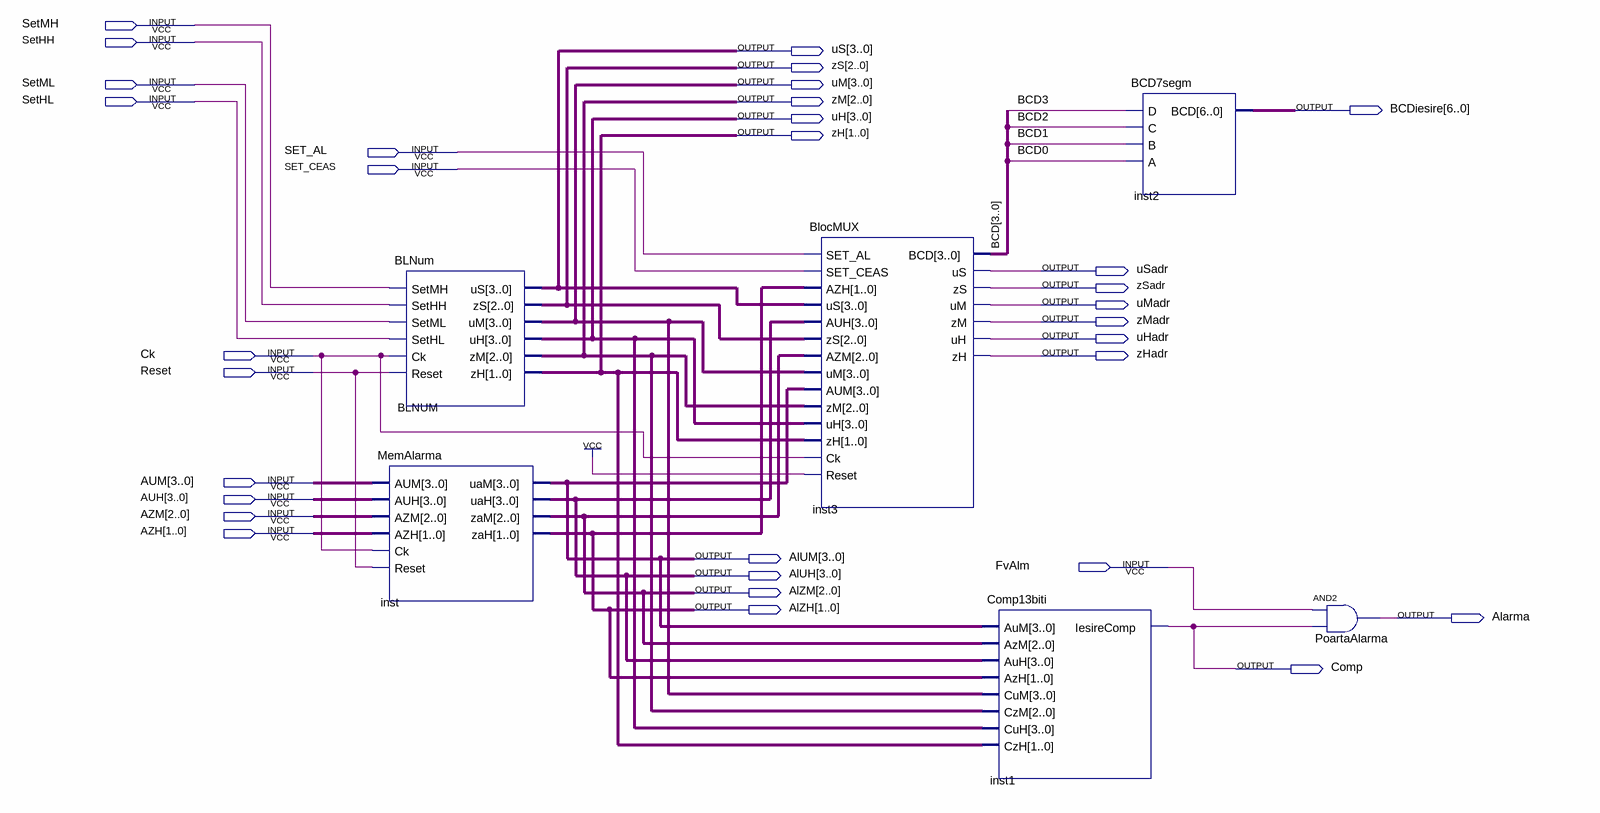
[diagram p0: schematic sheet]
// Quartus schematic SchemaFinala.bdf as structural Verilog: 6 symbols, 32 pins
module SchemaFinala (
  input  SetMH,
  input  SetHH,
  input  SetML,
  input  SetHL,
  input  SET_AL,
  input  SET_CEAS,
  input  Ck,
  input  Reset,
  input  [3:0] AUM,
  input  [3:0] AUH,
  input  [2:0] AZM,
  input  [1:0] AZH,
  input  FvAlm,
  output [3:0] uS,
  output [2:0] zS,
  output [3:0] uM,
  output [2:0] zM,
  output [6:0] BCDiesire,
  output [3:0] uH,
  output [1:0] zH,
  output uSadr,
  output zSadr,
  output uMadr,
  output zMadr,
  output uHadr,
  output zHadr,
  output [3:0] AlUM,
  output [3:0] AlUH,
  output [2:0] AlZM,
  output [1:0] AlZH,
  output Alarma,
  output Comp
);

  wire [3:0] BCD;

  BLNum BLNUM (
    .SetMH(SetMH), .SetHH(SetHH), .SetML(SetML), .SetHL(SetHL), .Ck(Ck), .Reset(Reset), .uS(uS), .zS(zS),
    .uM(uM), .uH(uH), .zM(zM), .zH(zH));
  MemAlarma inst (
    .AUM(AUM), .AUH(AUH), .AZM(AZM), .AZH(AZH), .Ck(Ck), .Reset(Reset), .uaM(AlUM), .uaH(AlUH), .zaM(AlZM),
    .zaH(AlZH));
  BlocMUX inst3 (
    .SET_AL(SET_AL), .SET_CEAS(SET_CEAS), .AZH(AlZH), .uS({uS, uSadr}), .AUH(AlUH), .zS({zS, zSadr}),
    .AZM(AlZM), .uM({uM, uMadr}), .AUM(AlUM), .zM({zM, zMadr}), .uH({uH, uHadr}), .zH({zH, zHadr}), .Ck(Ck),
    .Reset(1'b1), .BCD(BCD));
  Comp13biti inst1 (
    .AuM(AlUM), .AzM(AlZM), .AuH(AlUH), .AzH(AlZH), .CuM(uM), .CzM(zM), .CuH(uH), .CzH(zH), .IesireComp(Comp));
  BCD7segm inst2 (.D(BCD[3]), .C(BCD[2]), .B(BCD[1]), .A(BCD[0]), .BCD(BCDiesire));
  and PoartaAlarma (Alarma, FvAlm, Comp);
endmodule
